# Altium schematic sheet WIFI0320DD.SCHDOC
size A4; PageSetup: Record=PageOptions|CenterHorizontal=True|CenterVertical=True|PrintScale=1.00|XCorrection=1.00|YCorrection=1.00|PrintKind=0|BorderSize=5000000|LeftOffset=0|BottomOffset=0|Orientation=2|PaperLength=1000|PaperWidth=1000|Scale=100|PaperSource=1|PrintQuality=300|MediaType=1|DitherType=10|PaperKind=A4|PrintScaleMode=1
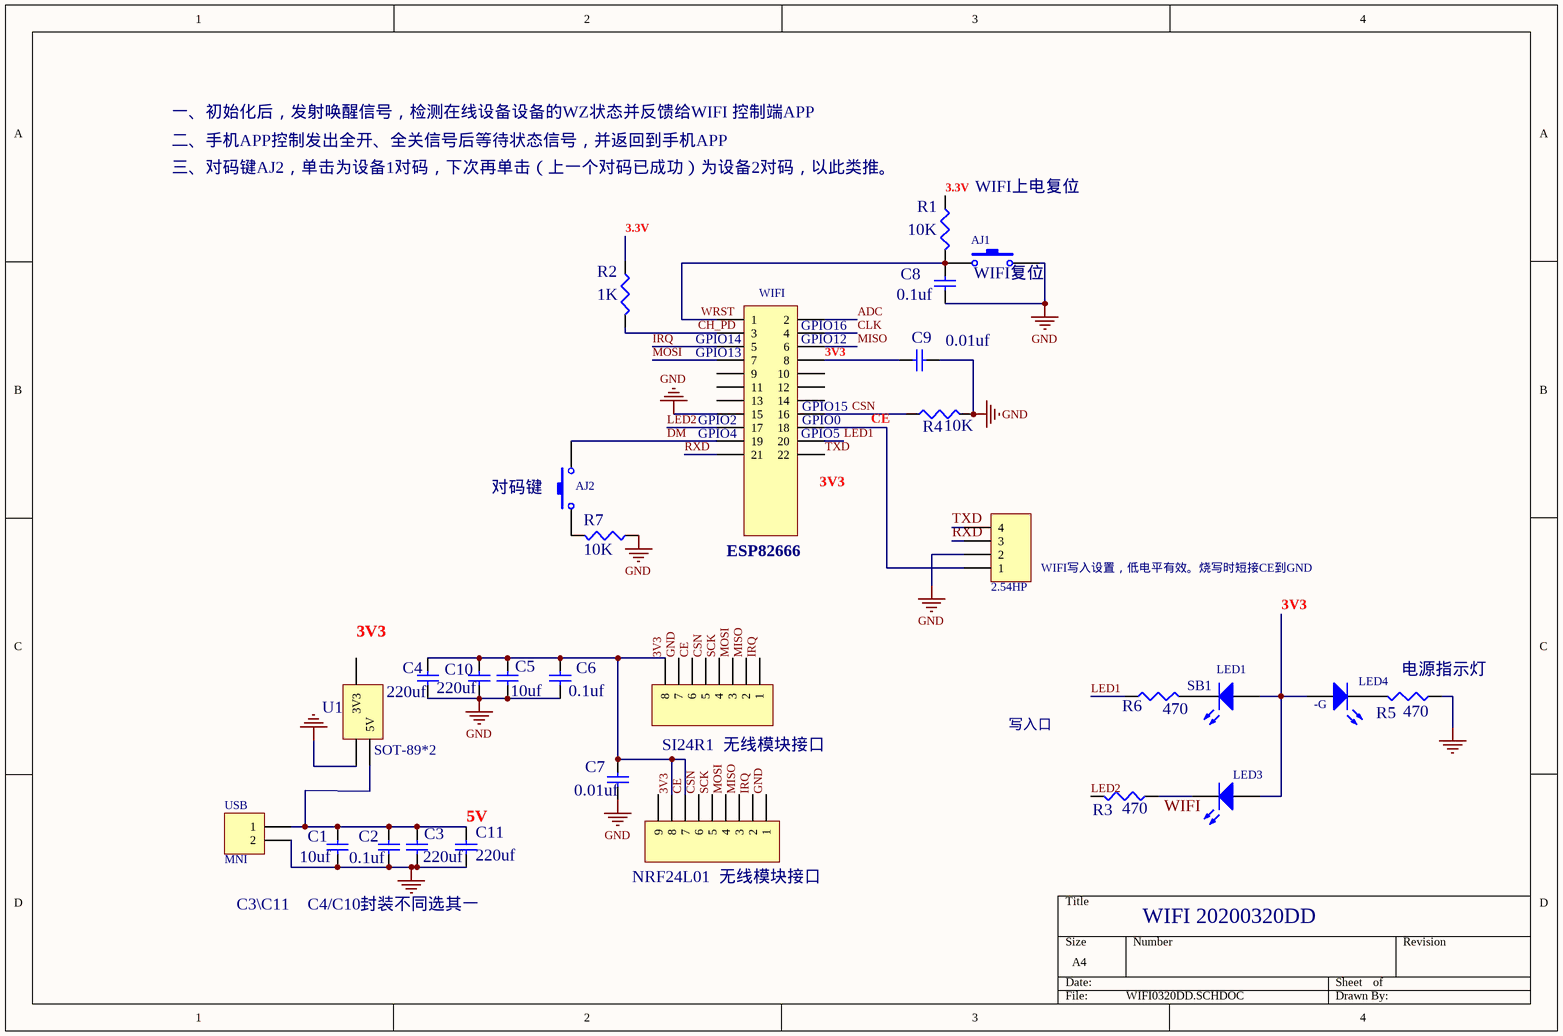
[diagram p0: WIFI0320DD.SCHDOC]

## Parts
?  LED3  [SMD _LED]
AJ1  WIFI复位  [SPST-2]
AJ2  XHDM1-4  [SPST-2]  (value not drawn)
C1  value 10uf  [CC1608-0603]
C2  value 0.1uf  [CC1608-0603]
C3  value 220uf  [CC1608-0603]
C4  value 220uf  [CC1608-0603]
C5  value 10uf  [CC1608-0603]
C6  value 0.1uf  [CC1608-0603]
C7  value 0.01uf  [CC1608-0603]
C8  value 0.1uf  [CC1608-0603]
C9  value 0.01uf  [CC1608-0603]
C10  value 220uf  [CC1608-0603]
C11  value 220uf  [CC1608-0603]
LED4  -G  [SMD _LED]
NRF24L01_无线模块接口  Header 9  [HDR1X9]  (value not drawn)
R1  value 10K  [C1608-0603]
R2  value 1K  [C1608-0603]
R3  Publisher: 470  [C1608-0603]
R4  value 10K  [C1608-0603]
R5  value 470  [C1608-0603]
R6  Publisher: 470  [C1608-0603]
R7  Publisher: 10K  [C1608-0603]
SB1  LED1  [SMD _LED]
SI24R1_无线模块接口  Header 8  [HDR1X8]  (value not drawn)
U1  AMS1117-3.3  [MHDR2X2]  (value not drawn)
USB  MNI  [HDR1X2]
WIFI  ESP82666  [HDR2X16]
WIFI写入设置，低电平有效。烧写时短接CE到GND  2.54HP  [HDR1X4]

## Nets
GND: AJ1.2 C1.1 C2.2 C3.2 C4.1 C5.2 C6.2 C7.2 C8.2 C9.2 C10.2 C11.2 NRF24L01_无线模块接口.1 R4.2 R5.1 R7.2 SI24R1_无线模块接口.7 U1.3.3OUT USB.2 WIFI.15 WIFI写入设置，低电平有效。烧写时短接CE到GND.2
3.3V: R1.1 R2.1
3V3: ?.1(A) C4.2 C5.1 C6.1 C7.1 C9.1 C10.1 LED4.1(A) NRF24L01_无线模块接口.7 NRF24L01_无线模块接口.8 SB1.1(A) SI24R1_无线模块接口.6 SI24R1_无线模块接口.8 WIFI.8 WIFI.18 WIFI写入设置，低电平有效。烧写时短接CE到GND.1  [also labelled CE]
5V: C1.2 C2.1 C3.1 C11.1 U1.3.3_IN(5V) USB.1
ADC: WIFI.2
CH_PD: R2.2 WIFI.3
CLK: WIFI.4
CSN: NRF24L01_无线模块接口.6 R4.1 SI24R1_无线模块接口.5 WIFI.16
DM: AJ2.1 WIFI.19
IRQ: NRF24L01_无线模块接口.2 SI24R1_无线模块接口.1 WIFI.5
LED1: R6.2 WIFI.20
LED2: R3.1 WIFI.17
MISO: NRF24L01_无线模块接口.3 SI24R1_无线模块接口.2 WIFI.6
MOSI: NRF24L01_无线模块接口.4 SI24R1_无线模块接口.3 WIFI.7
RXD: WIFI.21 WIFI写入设置，低电平有效。烧写时短接CE到GND.3
SCK: NRF24L01_无线模块接口.5 SI24R1_无线模块接口.4
TXD: WIFI.22 WIFI写入设置，低电平有效。烧写时短接CE到GND.4
WRST: AJ1.1 C8.1 R1.2 WIFI.1
Net?_2: ?.2(K) R3.2
NetAJ2_2: AJ2.2 R7.1
NetLED4_2: LED4.2(K) R5.2
NetR6_1: R6.1 SB1.2(K)

Not connected (* = marked no-connect by the designer): NRF24L01_无线模块接口 9; U1 2(3V3); WIFI 9 10 11 12 13 14 23 24 25 26 27 28 29 30 31 32

## Notes on the sheet
- 一、初始化后，发射唤醒信号，检测在线设备设备的WZ状态并反馈给WIFI 控制端APP
- 二、手机APP控制发出全开、全关信号后等待状态信号，并返回到手机APP
- 三、对码键AJ2，单击为设备1对码，下次再单击（上一个对码已成功）为设备2对码，以此类推。
- (near R1) WIFI上电复位
- (near WIFI) GPIO14
- (near WIFI) GPIO13
- (near WIFI) GPIO16
- (near WIFI) GPIO12
- (near WIFI) GPIO2
- (near WIFI) GPIO4
- (near WIFI) GPIO5
- (near WIFI) GPIO15
- (near WIFI) GPIO0
- 对码键
- (near R5) 电源指示灯
- (near U1) SOT-89*2
- 写入口
- C3\C11    C4/C10封装不同选其一
- WIFI 20200320DD
- Labels drawn without touching a wire or pin: 3V3, WIFI

## Library data of the parts
? LED4 SB1 = LED3: Typical BLUE SiC LED; Published: 8-Jun-2000; LatestRevisionDate: 17-Dec-2003; LatestRevisionNote: PCB Footprint replaced.; Publisher: Altium Limited
AJ1 AJ2 = SW-PB: Switch; Published: 24-Mar-1999; LatestRevisionDate: 17-Jul-2002; LatestRevisionNote: Re-released for DXP Platform.; Publisher: Altium Limited
C1-C11 = Cap Semi: Capacitor (Semiconductor SIM Model); Published: 8-Jun-2000; LatestRevisionDate: 17-Jul-2002; LatestRevisionNote: Re-released for DXP Platform.; PackageReference: C1206; Publisher: Altium Limited
NRF24L01_无线模块接口 = Header 9: Header, 9-Pin; LatestRevisionDate: 17-Jul-2002; LatestRevisionNote: Re-released for DXP Platform.; Publisher: Altium Limited
R1-R7 = Res3: Resistor; Published: 8-Jun-2000; LatestRevisionDate: 17-Jul-2002; LatestRevisionNote: Re-released for DXP Platform.
  R1 R2 R4 R5: Publisher: Altium Limited
SI24R1_无线模块接口 = Header 8: Header, 8-Pin; LatestRevisionDate: 17-Jul-2002; LatestRevisionNote: Re-released for DXP Platform.; Publisher: Altium Limited
U1 = MHDR2X2: Header, 2-Pin, Dual row; LatestRevisionDate: 17-Jul-2002; LatestRevisionNote: Re-released for DXP Platform.; Publisher: Altium Limited
USB = Header 2: Header, 2-Pin; LatestRevisionDate: 17-Jul-2002; LatestRevisionNote: Re-released for DXP Platform.; Publisher: Altium Limited
WIFI = Header 16X2: Header, 16-Pin, Dual row; LatestRevisionDate: 17-Jul-2002; LatestRevisionNote: Re-released for DXP Platform.; Publisher: Altium Limited
WIFI写入设置，低电平有效。烧写时短接CE到GND = Header 4: Header, 4-Pin; LatestRevisionDate: 17-Jul-2002; LatestRevisionNote: Re-released for DXP Platform.; Publisher: Altium Limited